# EasyEDA schematic A-1_SINGLE_STEP_2021-06-04.json
TITLE: APPLE-1 SINGLE STEP; REV: 1.2; Date: 2021-05-23; Sheet: 1/1; Drawn By: CP; Company: P-LAB
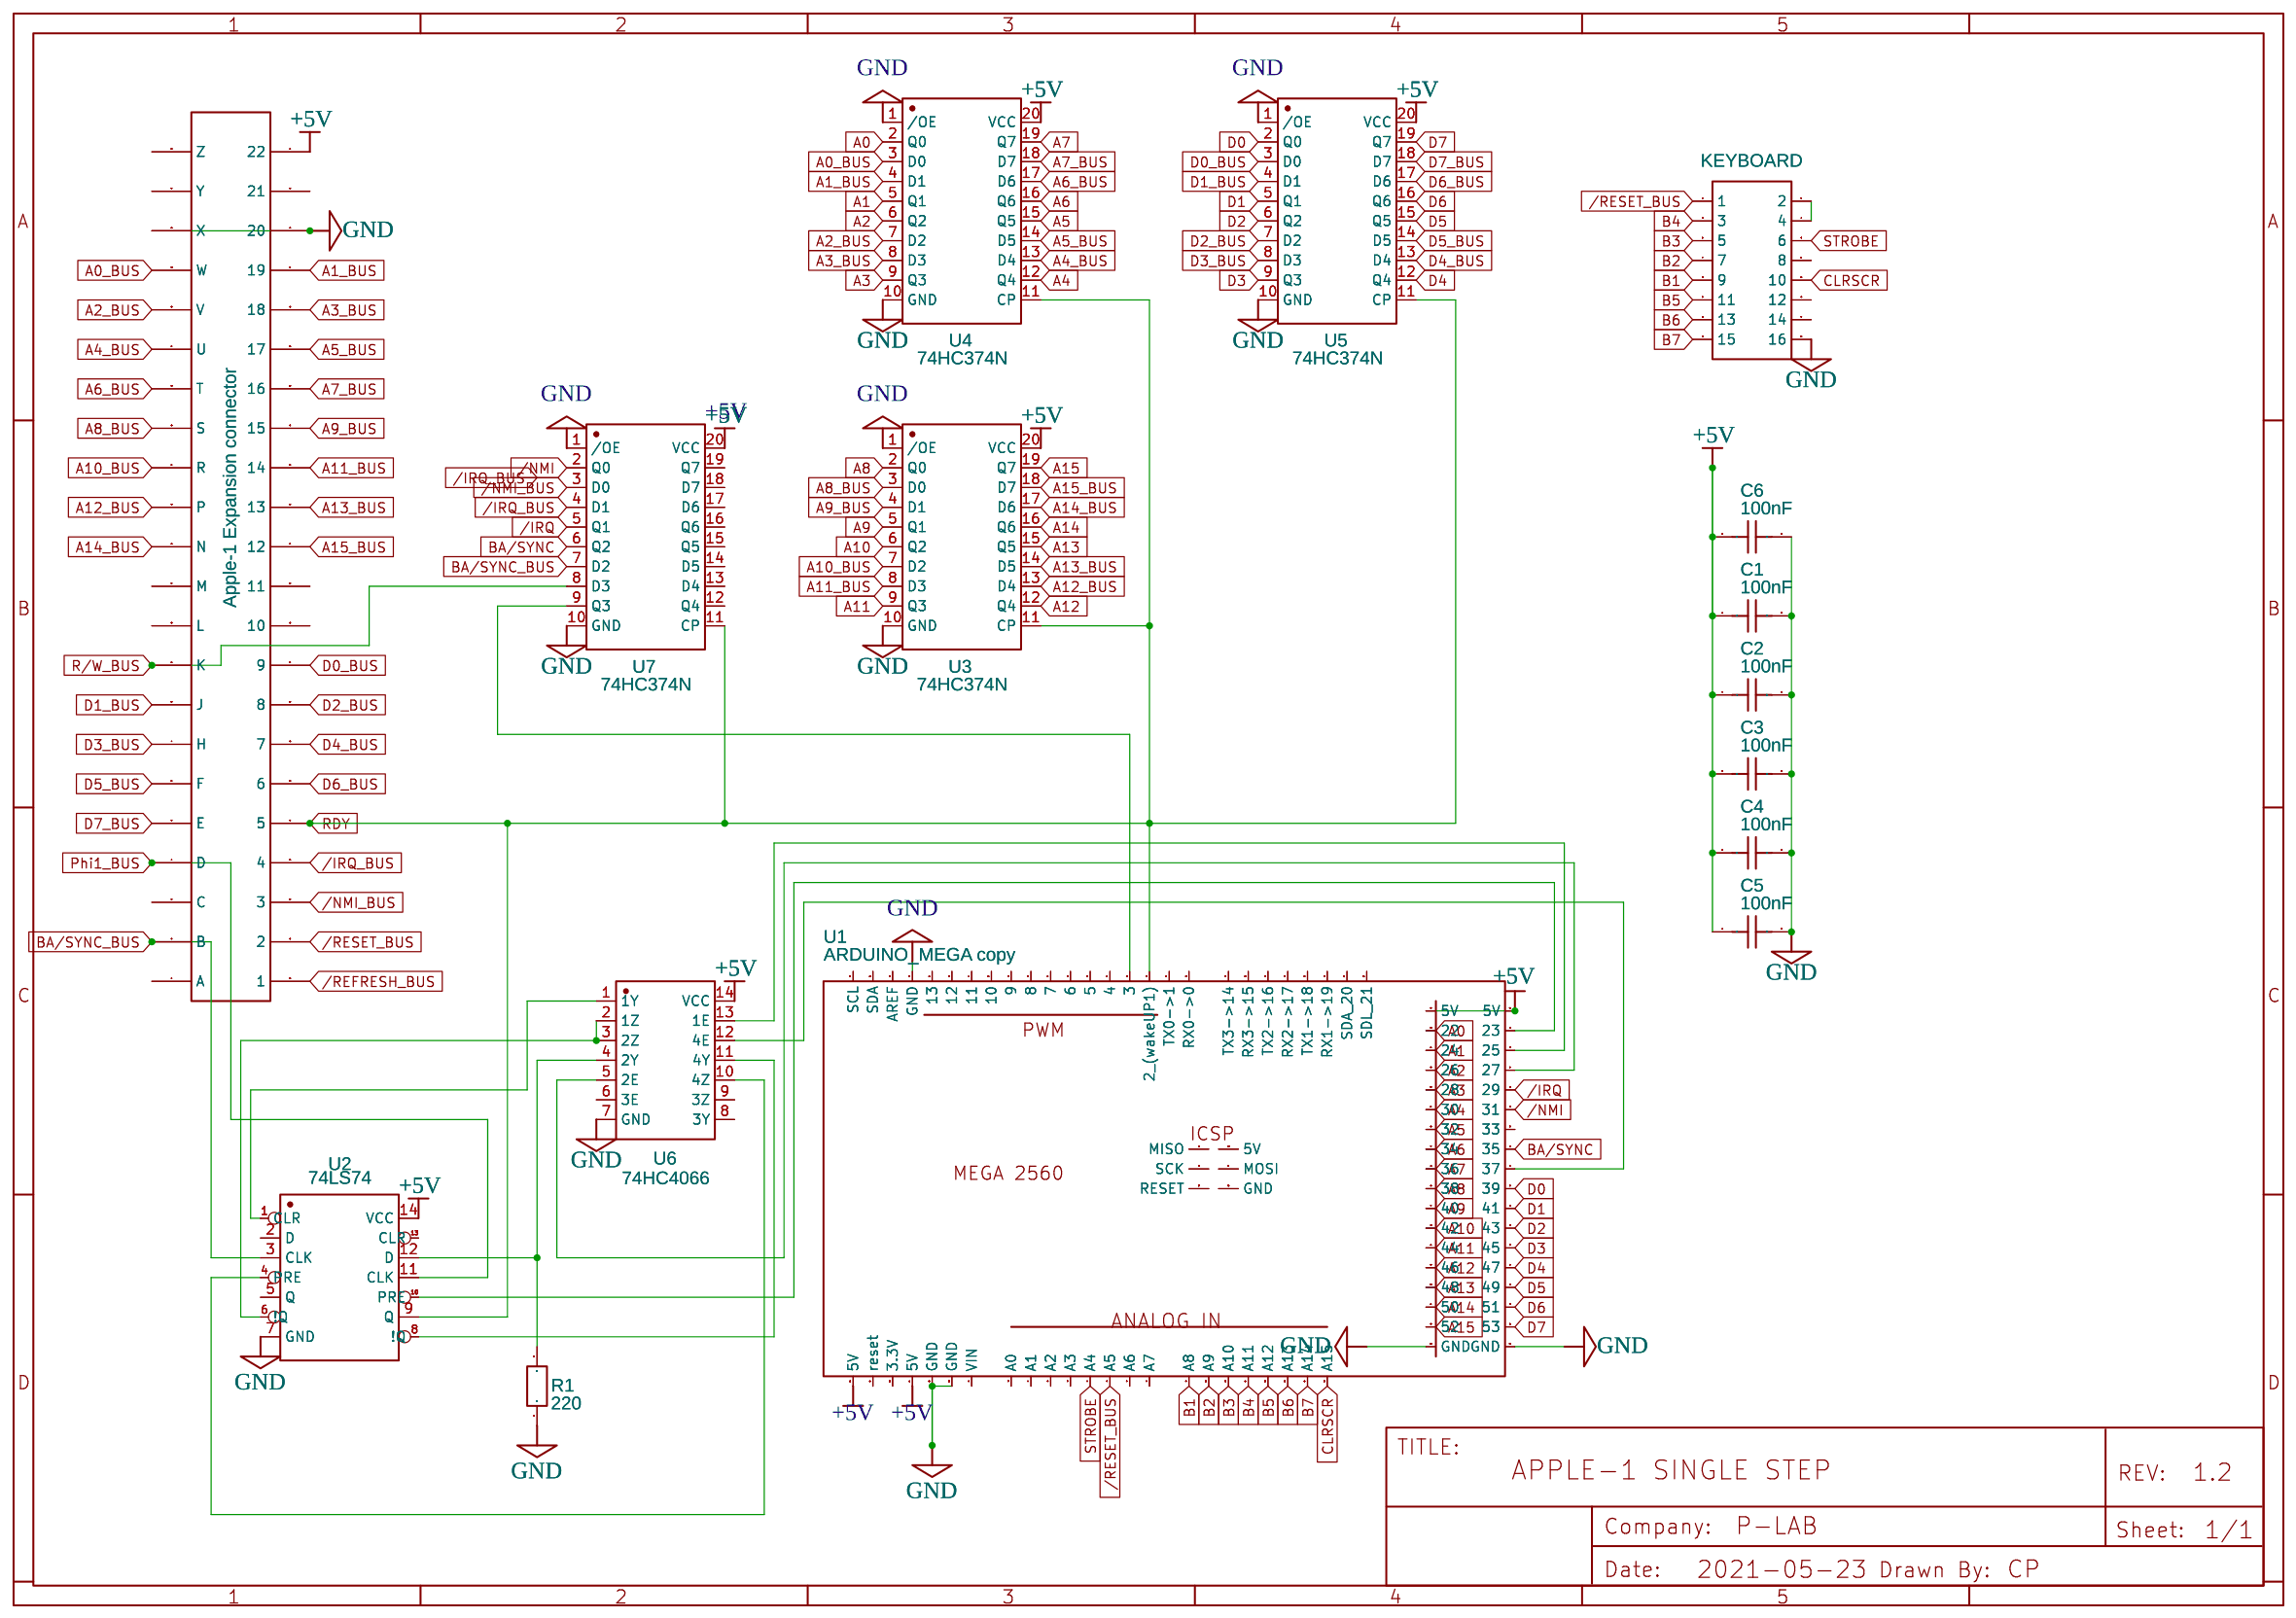
[diagram p0: schematic sheet]

## Parts
C1  100nF  [CAP-TH_L4.8-W3.2-P5.08-D1.2]
C2  100nF  [CAP-TH_L4.8-W3.2-P5.08-D1.2]
C3  100nF  [CAP-TH_L4.8-W3.2-P5.08-D1.2]
C4  100nF  [CAP-TH_L4.8-W3.2-P5.08-D1.2]
C5  100nF  [CAP-TH_L4.8-W3.2-P5.08-D1.2]
C6  100nF  [CAP-TH_L4.8-W3.2-P5.08-D1.2]
J1  Apple-1 Expansion connector  [EDAC_CARD_EDGE_2X22_PIN_3.96]
KEYBOARD  Header 2x8  [HDR-F-2.54_2X8]
R1  220  [RES-TH_BD2.4-L6.3-P10.30-D0.6]
U1  ARDUINO_MEGA copy  [ARDUINO_MEGA2560]
U2  74LS74  [DIP14]
U3  74HC374N  [DIP20]
U4  74HC374N  [DIP20]
U5  74HC374N  [DIP20]
U6  74HC4066  [DIP14]
U7  74HC374N  [DIP20]

## Library data of the parts
C1-C6 = CT4G-0805-2X1-50V-0.1UF-K: Supplier: LCSC; Supplier Part: C141981; Manufacturer: TORCH; Manufacturer Part: CT4G-0805-2X1-50V-0.1uF-K; Contributor: LCSC
J1 = EDAC_Card_Edge_Female_2x22_pin_3.96mm: Manufacturer Part: 306-018-520-102; Contributor: burek; Package Display: No
KEYBOARD = Header 2x8: Contributor: JasonJDDaniel
R1 = RN 1/4W 2R F T/B A1: Supplier: LCSC; Supplier Part: C410658; Manufacturer: TyoHM; Contributor: LCSC; LCSC Assembly: Yes; SMT Type: Extend; Paste Type: expand
U1 = ARDUINO_MEGA copy: Manufacturer Part: ARDUINO MEGA; Contributor: pyfa1992
U2 = 7474: Contributor: Marta Hernández Jiménez
U3-U5 U7 = 74HC374N
U6 = 74HC4066D-Q100,118: Supplier: LCSC; Supplier Part: C547030; Manufacturer: Nexperia; Contributor: LCSC

## Nets
+5V: C1.1 C2.1 C3.1 C4.1 C5.1 C6.1 J1.44(22) U1.5V U1.5V.(5V) U1.5V..(5V) U1.5V...(5V) U2.14(VCC) U3.20(VCC) U4.20(VCC) U5.20(VCC) U6.14(VCC) U7.20(VCC)
GND: C1.2 C2.2 C3.2 C4.2 C5.2 C6.2 J1.20(X) J1.42(20) KEYBOARD.16 R1.1 U1.GND U2.7(GND) U3.1(/OE) U3.10(GND) U4.1(/OE) U4.10(GND) U5.1(/OE) U5.10(GND) U6.7(GND) U7.1(/OE) U7.10(GND)
/IRQ: U1.36(29) U7.5(Q1)
/IRQ_BUS: J1.26(4) U7.4(D1)
/NMI: U1.38(31) U7.2(Q0)
/NMI_BUS: J1.25(3) U7.3(D0)
/REFRESH_BUS: J1.23(1)
/RESET_BUS: J1.24(2) KEYBOARD.1 U1.73(A5)
A0: U1.29(22) U4.2(Q0)
A0_BUS: J1.19(W) U4.3(D0)
A1: U1.31(24) U4.5(Q1)
A1_BUS: J1.41(19) U4.4(D1)
A2: U1.33(26) U4.6(Q2)
A2_BUS: J1.18(V) U4.7(D2)
A3: U1.35(28) U4.9(Q3)
A3_BUS: J1.40(18) U4.8(D3)
A4: U1.37(30) U4.12(Q4)
A4_BUS: J1.17(U) U4.13(D4)
A5: U1.39(32) U4.15(Q5)
A5_BUS: J1.39(17) U4.14(D5)
A6: U1.41(34) U4.16(Q6)
A6_BUS: J1.16(T) U4.17(D6)
A7: U1.43(36) U4.19(Q7)
A7_BUS: J1.38(16) U4.18(D7)
A8: U1.45(38) U3.2(Q0)
A8_BUS: J1.15(S) U3.3(D0)
A9: U1.47(40) U3.5(Q1)
A9_BUS: J1.37(15) U3.4(D1)
A10: U1.49(42) U3.6(Q2)
A10_BUS: J1.14(R) U3.7(D2)
A11: U1.51(44) U3.9(Q3)
A11_BUS: J1.36(14) U3.8(D3)
A12: U1.53(46) U3.12(Q4)
A12_BUS: J1.13(P) U3.13(D4)
A13: U1.55(48) U3.15(Q5)
A13_BUS: J1.35(13) U3.14(D5)
A14: U1.57(50) U3.16(Q6)
A14_BUS: J1.12(N) U3.17(D6)
A15: U1.59(52) U3.19(Q7)
A15_BUS: J1.34(12) U3.18(D7)
B1: KEYBOARD.9 U1.70(A8)
B2: KEYBOARD.7 U1.69(A9)
B3: KEYBOARD.5 U1.68(A10)
B4: KEYBOARD.3 U1.67(A11)
B5: KEYBOARD.11 U1.66(A12)
B6: KEYBOARD.13 U1.65(A13)
B7: KEYBOARD.15 U1.64(A14)
BA/SYNC: U1.42(35) U7.6(Q2)
BA/SYNC_BUS: J1.2(B) U2.3(CLK) U7.7(D2)
CLRSCR: KEYBOARD.10 U1.63(A15)
D0: U1.46(39) U5.2(Q0)
D0_BUS: J1.31(9) U5.3(D0)
D1: U1.48(41) U5.5(Q1)
D1_BUS: J1.8(J) U5.4(D1)
D2: U1.50(43) U5.6(Q2)
D2_BUS: J1.30(8) U5.7(D2)
D3: U1.52(45) U5.9(Q3)
D3_BUS: J1.7(H) U5.8(D3)
D4: U1.54(47) U5.12(Q4)
D4_BUS: J1.29(7) U5.13(D4)
D5: U1.56(49) U5.15(Q5)
D5_BUS: J1.6(F) U5.14(D5)
D6: U1.58(51) U5.16(Q6)
D6_BUS: J1.28(6) U5.17(D6)
D7: U1.60(53) U5.19(Q7)
D7_BUS: J1.5(E) U5.18(D7)
Phi1_BUS: J1.4(D) U2.11(CLK)
R/W_BUS: J1.9(K) U7.8(D3)
RDY: J1.27(5) U1.16(2 (wakeUP1)) U2.9(Q) U3.11(CP) U4.11(CP) U5.11(CP) U7.11(CP)
STROBE: KEYBOARD.6 U1.74(A4)
Net-(KEYBOARD-2): KEYBOARD.2 KEYBOARD.4
Net-(R1-2): R1.2 U2.12(D) U6.4(2Y)
Net-(U1-15): U1.15(3) U7.9(Q3)
Net-(U1-30): U1.30(23) U2.10(PRE)
Net-(U1-32): U1.32(25) U6.13(1E)
Net-(U1-34): U1.34(27) U6.5(2E)
Net-(U1-44): U1.44(37) U6.12(4E)
Net-(U2-1): U2.1(CLR) U6.1(1Y)
Net-(U2-4): U2.4(PRE) U6.10(4Z)
Net-(U2-6): U2.6(!Q) U6.2(1Z) U6.3(2Z)
Net-(U2-8): U2.8(!Q) U6.11(4Y)

Not connected (* = marked no-connect by the designer): J1 1(A) 3(C) 10(L) 11(M) 21(Y) 22(Z) 32(10) 33(11) 43(21); KEYBOARD 8 12 14; U1 3(AREF) 5(13) 5VICSP(5V) 6(12) 7(11) 8(10) 9 10(8) 11(7) 12(6) 13(5) 14(4) 17(TX0->1) 18(RX0->0) 19(TX3->14) 20(RX3->15) 21(TX2->16) 22(RX2->17) 23(TX1->18) 24(RX1->19) 40(33) 71(A7) 72(A6) 75(A3) 76(A2) 77(A1) 78(A0) 83(3.3V) 84(reset) 86(MISO) 87(SCK) 88(RESET) 90(MOSI) SCL SCL2(SDL 21) SDA SDA2(SDA 20) VIN; U2 2(D) 5(Q) 13(CLR); U6 6(3E) 8(3Y) 9(3Z); U7 12(Q4) 13(D4) 14(D5) 15(Q5) 16(Q6) 17(D6) 18(D7) 19(Q7)

## Notes on the sheet
- +5V
